# EAGLE schematic design (EAGLE 9.5.1)
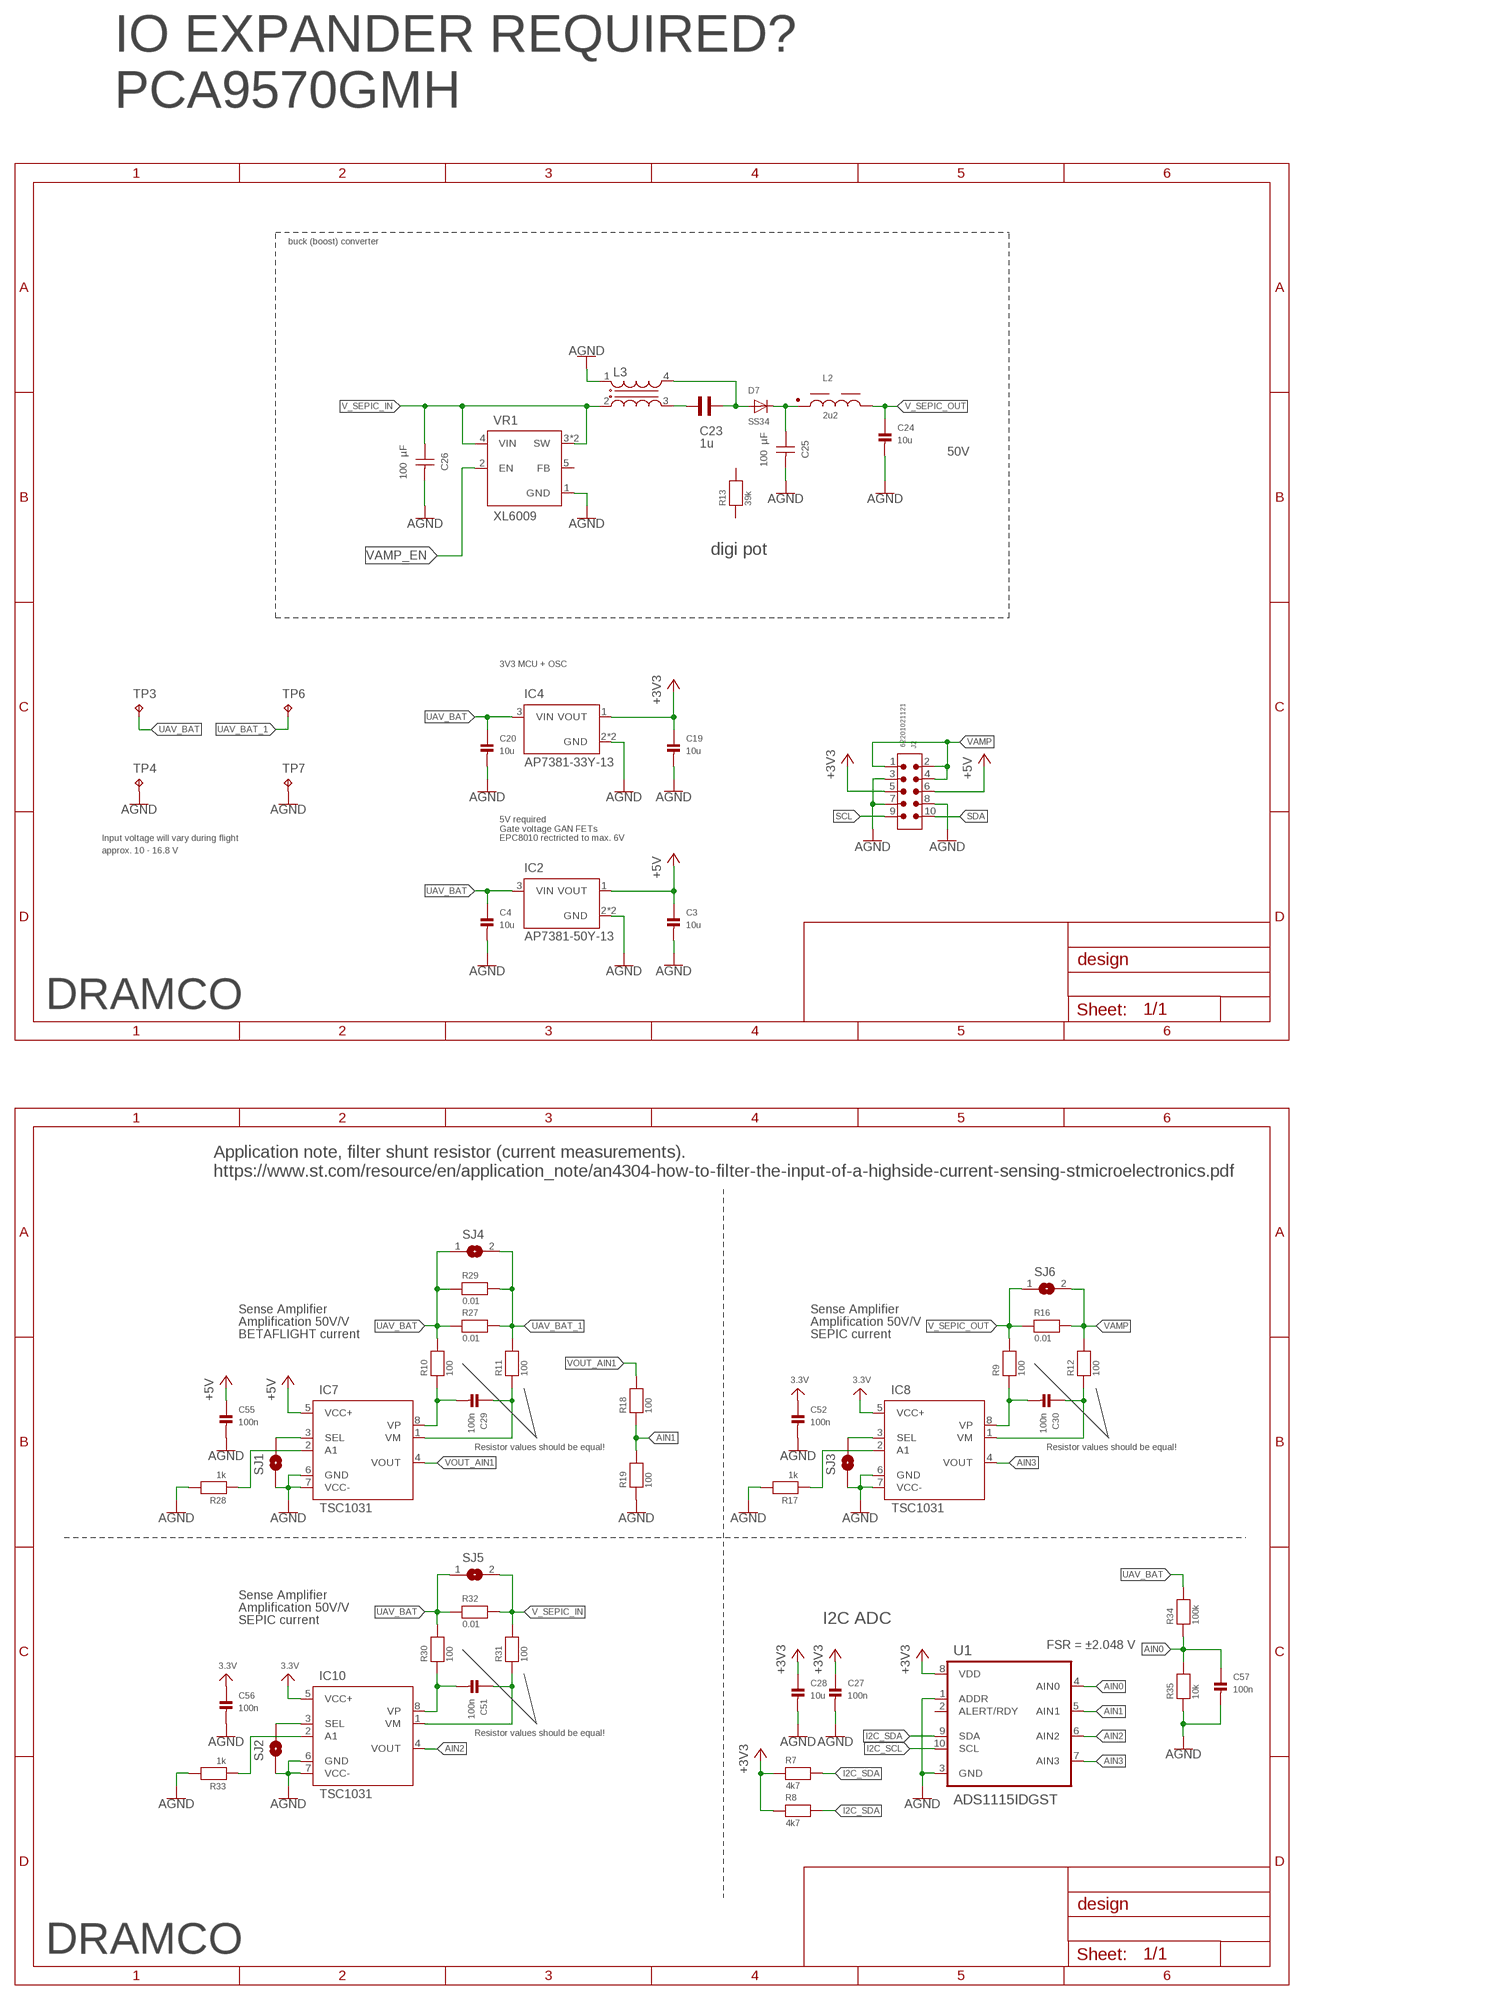
[diagram p0: schematic, sheet 1]

## Parts
C3  10u  CAP_CERAMIC0603  [0603]
C4  10u  CAP_CERAMIC0603  [0603]
C19  10u  CAP_CERAMIC0603  [0603]
C20  10u  CAP_CERAMIC0603  [0603]
C23  1u  WCAP-CSGP_0805_885012207103_WAVE  [WCAP-CSGP_0805_WAVE]
C24  10u  CAP_CERAMIC0805  [0805]
C25  100 µF  WCAP-ASNP_8X10.5_865250453009  [WCAP-ASNP_8X10.5(DXL)]
C26  100 µF  WCAP-ASNP_8X10.5_865250453009  [WCAP-ASNP_8X10.5(DXL)]
C27  100n  CAP_CERAMIC0603  [0603]
C28  10u  CAP_CERAMIC0603  [0603]
C29  100n  CAP_CERAMIC0402  [0402]
C30  100n  CAP_CERAMIC0402  [0402]
C51  100n  CAP_CERAMIC0402  [0402]
C52  100n  CAP_CERAMIC0402  [0402]
C55  100n  CAP_CERAMIC0402  [0402]
C56  100n  CAP_CERAMIC0402  [0402]
C57  100n  CAP_CERAMIC0603  [0603]
D7  SS34  DIODESOD-123  [SOD-123]
IC2  AP7381-50Y-13  [FOOT_XC6201P332PR-G]
IC4  AP7381-33Y-13  AP7381-50Y-13  [FOOT_XC6201P332PR-G]
IC7  TSC1031  TSC1031IPT  [SOP65P640X120-8N]
IC8  TSC1031  TSC1031IPT  [SOP65P640X120-8N]
IC10  TSC1031  TSC1031IPT  [SOP65P640X120-8N]
J2  62201021121  6220XX21121_62201021121  [62201021121]
L2  2u2  WE-LQS_3015_74404032022  [WE-LQS_3015]
L3  WE-DD_1280_744873150  [WE-DD_1260/1280]
R7  4k7  RESISTOR0603  [0603]
R8  4k7  RESISTOR0603  [0603]
R9  100  RESISTOR0603  [0603]
R10  100  RESISTOR0603  [0603]
R11  100  RESISTOR0603  [0603]
R12  100  RESISTOR0603  [0603]
R13  39k  RESISTOR0603  [0603]
R16  0.01  RESISTOR0805  [0805]
R17  1k  RESISTOR0603  [0603]
R18  100  RESISTOR0603  [0603]
R19  100  RESISTOR0603  [0603]
R27  0.01  RESISTOR0805  [0805]
R28  1k  RESISTOR0603  [0603]
R29  0.01  RESISTOR0805  [0805]
R30  100  RESISTOR0603  [0603]
R31  100  RESISTOR0603  [0603]
R32  0.01  RESISTOR0805  [0805]
R33  1k  RESISTOR0603  [0603]
R34  100k  RESISTOR0603  [0603]
R35  10k  RESISTOR0603  [0603]
SJ1  SOLDERJUMPERTRACE  [SJ_2S-TRACE]
SJ2  SOLDERJUMPERTRACE  [SJ_2S-TRACE]
SJ3  SOLDERJUMPERTRACE  [SJ_2S-TRACE]
SJ4  SOLDERJUMPERREFLOW  [SOLDERJUMPER_REFLOW]
SJ5  SOLDERJUMPERREFLOW  [SOLDERJUMPER_REFLOW]
SJ6  SOLDERJUMPERREFLOW  [SOLDERJUMPER_REFLOW]
TP3  TPTP20SQ  [TP20SQ]
TP4  TPTP20SQ  [TP20SQ]
TP6  TPTP20SQ  [TP20SQ]
TP7  TPTP20SQ  [TP20SQ]
U1  ADS1115IDGST  [SOP50P490X110-10N]
VR1  XL6009  [DPAK170P1435X465-6N]

## Nets
3.3V: C52.1 C56.1 IC8.5(VCC+) IC10.5(VCC+)
+3V3: C19.1 C27.1 C28.1 IC4.1(VOUT) J2.5 R7.1 R8.1 U1.8(VDD)
+5V: C3.1 C55.1 IC2.1(VOUT) IC7.5(VCC+) J2.6
AGND: C3.2 C4.2 C19.2 C20.2 C24.2 C25.2 C26.2 C27.2 C28.2 C52.2 C55.2 C56.2 C57.2 IC2.2(GND) IC2.2.1(GND) IC4.2(GND) IC4.2.1(GND) IC7.6(GND) IC7.7(VCC-) IC8.6(GND) IC8.7(VCC-) IC10.6(GND) IC10.7(VCC-) J2.3 J2.7 J2.8 L3.1 R17.2 R19.1 R28.2 R33.2 R35.1 SJ1.1 SJ2.1 SJ3.1 TP4.TP TP7.TP U1.1(ADDR) U1.3(GND) VR1.1(GND)
AIN0: C57.1 R34.1 R35.2 U1.4(AIN0)
AIN1: R18.1 R19.2 U1.5(AIN1)
AIN2: IC10.4(VOUT) U1.6(AIN2)
AIN3: IC8.4(VOUT) U1.7(AIN3)
I2C_SCL: U1.10(SCL)
I2C_SDA: R7.2 R8.2 U1.9(SDA)
N$3: C30.1 IC8.1(VM) R12.1
N$5: C23.1 D7.A L3.4
N$9: C23.2 L3.3
N$10: C25.1 D7.C L2.1
N$11: C30.2 IC8.8(VP) R9.1
N$12: IC8.3(SEL) SJ3.2
N$13: IC8.2(A1) R17.1
N$25: IC7.3(SEL) SJ1.2
N$26: C29.1 IC7.1(VM) R11.1
N$27: C29.2 IC7.8(VP) R10.1
N$29: C51.1 IC10.1(VM) R31.1
N$30: C51.2 IC10.8(VP) R30.1
N$31: IC7.2(A1) R28.1
N$32: IC10.3(SEL) SJ2.2
N$33: IC10.2(A1) R33.1
SCL: J2.9
SDA: J2.10
UAV_BAT: C4.1 C20.1 IC2.3(VIN) IC4.3(VIN) R10.2 R27.1 R29.1 R30.2 R32.1 R34.2 SJ4.1 SJ5.1 TP3.TP
UAV_BAT_1: R11.2 R27.2 R29.2 SJ4.2 TP6.TP
V_SEPIC_IN: C26.1 L3.2 R31.2 R32.2 SJ5.2 VR1.3(SW) VR1.4(VIN) VR1.6(SW)
V_SEPIC_OUT: C24.1 L2.2 R9.2 R16.1 SJ6.1
VAMP: J2.1 J2.2 J2.4 R12.2 R16.2 SJ6.2
VAMP_EN: VR1.2(EN)
VOUT_AIN1: IC7.4(VOUT) R18.2
Unconnected: R13.1 R13.2 U1.2(ALERT/RDY) VR1.5(FB)

## Notes on the sheet
- IO EXPANDER REQUIRED?
  PCA9570GMH
- buck (boost) converter
- 50V
- digi pot
- 3V3 MCU + OSC
- Input voltage will vary during flight
- 5V required
  Gate voltage GAN FETs
  EPC8010 rectricted to max. 6V
- approx. 10 - 16.8 V
- DRAMCO
- Application note, filter shunt resistor (current measurements). 
  https://www.st.com/resource/en/application_note/an4304-how-to-filter-the-input-of-a-highside-current-sensing-stmicroelectronics.pdf
- Sense Amplifier | Sense Amplifier
- Amplification 50V/V | Amplification 50V/V
- BETAFLIGHT current | SEPIC current
- Resistor values should be equal! | Resistor values should be equal!
- Sense Amplifier
- Amplification 50V/V
- SEPIC current | I2C ADC
- FSR = ±2.048 V
- Resistor values should be equal!
- DRAMCO

## Library data of the parts
C3 C4 C19 C20 C24 C27-C30 C51 C52 C55-C57 = microbuilder:CAP_CERAMIC: Ceramic Capacitors 0402 - 0402 Surface Mount Capacitors 16pF 50V 5% [Digikey: 445-4899-2-ND] 18pF 50V 5% [Digikey: 490-1281-2-ND] 22pF 50V 5% [Digikey: 490-1283-2-ND] 68pF 50V 5% [Digikey: 490-1289-2-ND] 0.1uF 10V 10% [Digikey: 490-1318-2-ND] 1.0uF 6.3V 10% [Digikey: 490-1320-2-ND] 0603 - 0603 Surface Mount Capacitors 16 pF 50V 5% [Digikey: 445-5051-2-ND] 22 pF 50V [Digikey: PCC220ACVTR-ND] 33 pF 50V 5% [Digikey: 490-1415-1-ND] 56pF 50V 5% [Digikey: 490-1421-1-ND] 220pF 50V 5% [Digikey: 445-1285-1-ND] 680 pF 50V 2200 pF 50V 5% C0G [Digikey: 445-1297-1-ND] 5600 pF 100V 5% X7R [Digikey: 478-3711-1-ND] 0.1 µF 25V 10% [Digikey: PCC2277TR-ND] 0.22 µF 16V 10% X7R [Digikey: 445-1318-1-ND] 1.0 µF 25V 10% [Digikey: 445-5146-2-ND] 0603 - RF Specific 3pF 250V +/-0.1pF RF [Digikey: 712-1347-1-ND] 18 pF 250V 5% [Digikey: 478-3505-1-ND or 712-1322-1-ND] 56 pF 250V 5% C0G RF [Digikey: 490-4867-1-ND] 68 pF 250V RF [Digikey: 490-4868-1-ND] 0805 - 0805 Surface Mount Capacitors 220 pF 250V 2% RF Ceramic Capacitor [Digikey: 712-1398-1-ND] 1000 pF 50V 2% NP0 Ceramic Capacitor [Digikey: 478-3760-1-ND] 0.1 µF 25V 10% Ceramic Capacitor [Digikey: PCC1828TR-ND] 1.0 µF 16V 10% Ceramic Capacitor[Digikey: 490-1691-2-ND] 10.0 µF 10V 10% Ceramic Capacitor[Digikey: 709-1228-1-ND] 10.0 uF 16V 10% Ceramic Capacitor [Digikey: 478-5165-2-ND] 47 uF 6.3V 20% Ceramic Capacitor [Digikey: 587-1779-1-ND or 399-5506-1-ND] 1206 - 1206 Surface Mount Capacitors 47uF 10V 20% Ceramic Capacitor [Digikey: 490-5528-1-ND or 399-5508-1-ND or 445-6010-1-ND] 100uF 6.3V -20%, +80% Y5V Ceramic Capacitor (Digikey: 490-4512-1-ND, Mouser: 81-GRM31CF50J107ZE1L)
C23 = Kondensatoren (rev17a):WCAP-CSGP_0805: WCAP-CSGP Ceramic Capacitors Characteristics Multilayer Ceramic Chip Capacitor Recommended soldering:Reflow, for 0603 and 0805 wave soldering is also allowed Operating temperature:-55 °C to +125 °C; Ceramic characteristics: Class I - NPO ; Class II -X7R, X5R High performance ceramic High capacitance stability Minimal aging Termination:Cu/Ni/Sn <http://katalog.we-online.de/media/images/eisos/WCAP-CSGP_pf2.jpg> Details see: http://katalog.we-online.de/en/pbs/WCAP-CSGP-0805? Created: 2015-01-28 2015 (C) Wurth Elektronik
C25 C26 = Eagle_WCAP-ASNP (rev20a):WCAP-ASNP_8X10.5: WCAP-ASNP Aluminium Electrolytic Capacitors Non-Polar +85 °C Characteristics Non-polarized product series with max. operating temperature of +85°C Mounting style: V-Chip SMT Capacitance range: 0.1 µF ‒ 560 µF Capacitance tolerance: ±20 % Voltage range (UR): 6.3 ‒ 50 V(DC) Operating temperature: -40 °C up to +85 °C Endurance: 2000 h @ +85 °C Dimensions (DxL) in mm: 4.0 x 5.5 up to 10.0 x 10.5 Recommended soldering: Reflow soldering Applications Reverse polarity protected Filtering Coupling e.g. TV, audio, digital camera <https://www.we-online.com/catalog/media/o14726v209%20Family_WCAP-ASNP.jpg> Details see: https://www.we-online.com/catalog/en/WCAP-ASNP/ Updated by yingchun,Shan;2020-03-03 2020(C) Würth Elektronik; DATASHEET-URL: https://www.we-online.com/catalog/datasheet/865250453009.pdf; DF: 17%; DIAMETER: 8mm; I-LEAK: 125uA; I-RIPPLE: 130mA; L: 10.5mm; OPERATING-TEMPERATURE: -40 °C up to +85 °C; PART-NUMBER: 865250453009; TECHNICAL-REFERENCE: ASBE105101M025DVCTEB000; VR: 25V(DC); Z: 0.308167Ohm
D7 = microbuilder:DIODE: Diode SMA Model Volts Amps Type Vf Vr Digikey # Notes SSA34-E3 40V 3A Schottky 480mV @ 3A 200uA @ 40V SSA34-E3/61TGITR-ND CDBA120-G 20V 1A Schottky 500mV @ 1A 500uA @ 20V 641-1014-6-ND REEL MBRA210 10V 2A Schottky 350mV @ 2A 700uA @ 10V MBRA210LT3 SOD-123 Model Volts Amps Type Vf Vr Order # Notes BAT54T1G 30V 200mA Schottky 800mV @ 200mA 2uA @ 25V BAT54T1GOSTR-ND B0530W 30V 500mA Schottky 430mV @ 500mA 130uA @ 30V B0530W-FDICT-ND REEL MBR120 1A 20V Schottky 340mV @ 1A MBR120VLSFT1GOSCT-ND SOD-323 Model Volts Amps Type Vf Vr Order # Notes PMEG2005EJ 20V 500mA Schottky 355mV @ 500mA 568-4110-1-ND ZLLS410 10V 570mA Schottky 380mV @ 570mA ZLLS410CT-ND 1N4148WS 75V 150mA Silicon/Simple 1V 1N4148WSFSCT-ND REEL SOD-523 Model Volts Amps Type Vf Vr Order # Notes BAT54XV2 30V 200mA Schottky 0.8V @ 100mA BAT54XV2CT-ND TB751S 30V 30mA Schottky RB751S-40TE61CT-ND SOT23-R/W (R = Solder Paste/Reflow Ovens, W = Hand-Soldering) Model Volts Amps Type Vf Vr Order # Notes BAT54FILM 40V 300mA Schottky 497-7162-1-ND
IC2 IC4 = AP7381:AP7381-50Y-13: 250mA CMOS LDO, Isupply 1uA and 2% Vout Accuracy 3 SOT-89 T/R; AVAILABILITY: Unavailable; DESCRIPTION: 250mA CMOS LDO, Isupply 1uA and 2% Vout Accuracy 3 SOT-89 T/R; MF: Microchip; MP: MCP1700T-3602E/MB; PACKAGE: SOT-89 Microchip; PRICE: None
IC7 IC8 IC10 = TSC1031:TSC1031IPT
J2 = Eagle_WR-PHD (rev22a):6220XX21121_62201021121: WR-PHD 1.27 mm THT Dual Pin Header ARTICLE PROPERTIES: Pins:4;​ 8;​ 10;​ 14;​ 16;​ 20;​ 28 KIND PROPERTIES: Pitch：1.27 mm Quality Class:3 as per CECC 75 301-802 Rows：Dual Gender：Pin Header Type：Straight MATERIAL PROPERTIES: Insulator Material :PA9T Insulator Flammability Rating:UL94 V-0 Contact Material:Copper Alloy Contact Plating:Gold Contact Type:Stamped GENERAL INFORMATION Operating Temperature:-40 up to +105 °C Compliance:Lead free / RoHS ELECTRICAL PROPERTIES: Rated Current:1 A;​ max. IR1:1 A Withstanding Voltage:500 V (AC) Contact Resistance:20 mΩ RISO:1000 MΩ CERTIFICATION UL Approval:E323964 PACKAGING PROPERTIES Packaging:Box Packaging Unit:1000;​ 800;​ 500;​ 200 <https://katalog.we-online.com/media/images/v2/o33223v209%20Family_WR-PHD_6220xx21121.jpg> Details see: https://katalog.we-online.com/en/em/PHD_1_27_THT_DUAL_PIN_HEADER_6220XX21121 Updated by Yingchun,Shan 2019-10-25 2019 (C) Würth Elektronik; DATASHEET-URL: https://www.we-online.com/redexpert/spec/62201021121?ae; GENDER: Pin Header; IR: 1A; MOUNT: THT; PACKAGING: Box; PART-NUMBER: 62201021121; PINS: 10; PITCH: 1.27mm; ROWS: Dual; TYPE: Straight
L2 = EMCComponents (rev19b):WE-LQS_3015: SMD Shielded Tiny Power Inductor Characteristics Tiny Power Inductor design 1.7 times more current in comparison with unshielded versions Robust design & high durability Low RDC Magnetically shielded with magnetic glue reducing buzz noise in ultra-low levels Operating Temperature: –40 °C to +125 °C Applications Integrated DC/DC Converters Switching controllers which required high efficiency Portable power (Smartphones, digital cameras, Tablets, etc.) Embedded laptops and PCs Big sizes (5040, 60xx, 8040) used for shock-proof circuits <http://katalog.we-online.de/media/images/v2/Family_WE-LQS.jpg> Details see: http://katalog.we-online.de/en/pbs/WE-LQS Created by Dan Xu 2014-05-21 2014 (C) Wurth Elektronik; WE-NUMBER: 74404032022/2,2uH
L3 = PowerMagnetics (rev18e):WE-DD_1280: WE-DD SMD Shielded Coupled Inductor Characteristics 1:1 transformer Double inductor with two identical windings 4 different sizes available Operating temperature: –40 ºC to +125 ºC Recommended solder profile: Reflow Custom designs on request Applications For SEPIC and CUK topologies Flyback applications Switching regulators with second, unregulated output voltages <http://katalog.we-online.de/media/images/v2/Family_WE-DD.jpg> Details see: http://katalog.we-online.de/en/pbs/WE-DD Updated by Dan Xu 2014-06-10 2014 (C) Wurth Elektronik; WE-NUMBER: 744873150/15uH
R7-R13 R16-R19 R27-R35 = microbuilder:RESISTOR: Resistors 0402 - 0402 Surface Mount Package 22 Ohm 1% 1/16W [Digikey: 311-22.0LRTR-ND] 33 Ohm 5% 1/16W 1.0K 5% 1/16W 1.5K 5% 1/16W 2.0K 1% 1/16W 10.0K 1% 1/16W [Digikey: 311-10.0KLRTR-ND] 10.0K 5% 1/16W [Digikey: RMCF0402JT10K0TR-ND] 12.1K 1% 1/16W [Digikey: 311-22.0LRTR-ND] 100.0K 5% 1/16W 0603 - 0603 Surface Mount Package 0 Ohm 1/10 Watt 1% Resistor 15 Ohm 1/10 Watt 1% Resistor 33 Ohm 1/10 Watt 1% Resistor 49.9 Ohm 1/10 Watt 1% Resistor 100 Ohm 1/10 Watt 1% Resistor 150 Ohm 1/10 Watt 1% Resistor 240 Ohm 1/10 Watt 1% Resistor 390 Ohm 1/10 Watt 1% Resistor 560 Ohm 1/10 Watt 1% Resistor 680 Ohm 1/10 Watt 1% Resistor 750 Ohm 1/10 Watt 1% Resistor 1.0K Ohm 1/10 Watt 1% Resistor 1.5K Ohm 1/10 Watt 1% Resistor 2.0K Ohm 1/10 Watt 1% Resistor 2.2K Ohm 1/10 Watt 1% Resistor 3.3K Ohm 1/10 Watt 1% Resistor 4.7K Ohm 1/10 Watt 1% Resistor 10.0K Ohm 1/10 Watt 1% Resistor 12.0K Ohm 1/10 Watt 1% Resistor 12.1K Ohm 1/10 Watt 1% Resistor 20.0K Ohm 1/10 Watt 1% Resistor 33.0K Ohm 1/10 Watt 1% Resistor 100.0K Ohm 1/10 Watt 1% Resistor 0805 - 0805 Surface Mount Package 0 Ohm 1/8 Watt 1% Resistor 33 Ohm 1/8 Watt 1% Resistor 100 Ohm 1/8 Watt 1% Resistor 150 Ohm 1/8 Watt 1% Resistor 200 Ohm 1/8 Watt 1% Resistor 240 Ohm 1/8 Watt 1% Resistor 330 Ohm 1/8 Watt 1% Resistor 390 Ohm 1/8 Watt 1% Resistor 470 Ohm 1/8 Watt 1% Resistor 1.0K Ohm 1/8 Watt 1% Resistor 1.5K Ohm 1/8 Watt 1% Resistor 2.0K Ohm 1/8 Watt 1% Resistor 4.7K Ohm 1/8 Watt 1% Resistor 5.1K Ohm 1/8 Watt 1% Resistor 5.6K Ohm 1/8 Watt 1% Resistor 10.0K Ohm 1/8 Watt 1% Resistor 22.0K Ohm 1/8 Watt 1% Resistor 33.0K Ohm 1/8 Watt 1% Resistor 100K Ohm 1/8 Watt 1% Resistor 1206 - 1206 Surface Mount Package 2012 - 2010 Surface Mount Package 0.11 Ohm 1/2 Watt 1% Resistor - Digikey: RHM.11UCT-ND
SJ1-SJ3 = SparkFun-Retired:SOLDERJUMPER: Solder Jumper Standard SMD solder jumper. Used to automate production. Two varients : Normally Open and Normally Closed are the same, but have different paste layers. NC will have a large amount of paste and should jumper during reflow.
SJ4-SJ6 = microbuilder:SOLDERJUMPER: SMD Solder JUMPER Solder the two pads together to create a connection, or remove the solder to break it. REFLOW - Use this footprint for solder paste and reflow ovens. WAVE - Use this footprint for hand-soldering (larger pads). CLOSED - Has a trace between the two pads to ensure it is closed by default. The trace needs to be cut to disable the jumper, and can be closed again by creating a solder bridge between the two pads.
TP3 TP4 TP6 TP7 = testpad:TP: Test pad
U1 = ADS1115IDGST:ADS1115IDGST: Analog-to-Digital Converter with Internal Reference; AVAILABILITY: Unavailable; DESCRIPTION: 16-Bit ADC with Integrated MUX, PGA, Comparator, Oscillator, and Reference 10-VSSOP -40 to 125; MF: Texas Instruments; MP: ADS1115IDGST; PACKAGE: MSOP-10 Texas Instruments; PRICE: None
VR1 = XL6009:XL6009: The XL6009 regulator is a wide input range, current mode, DC/DC converter which is capable of generating either positive or negative output voltages. Check availability <https://pricing.snapeda.com/parts/XL6009/XLSEMI/view-part?ref=eda>; AVAILABILITY: Not in stock; DESCRIPTION: The XL6009 regulator is a wide input range, current mode, DC/DC converter which is capable of generating either positive or negative output voltages.; MF: XLSEMI; MP: XL6009; PACKAGE: TO-263-5L XLSEMI; PRICE: None